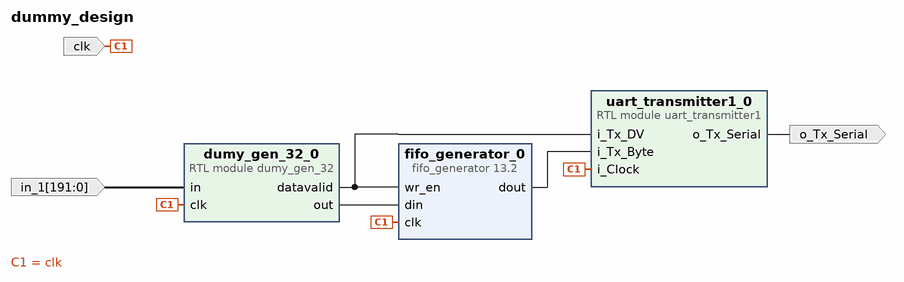
[diagram p0: block diagram of the top level]
# Vivado block design dummy_design, xcvu9p-flga2104-2L-e, Vivado 2019.1
create_bd_design dummy_design

create_bd_port -dir I -type clk clk
set_property -dict {CONFIG.FREQ_HZ 100000000} [get_bd_ports clk]
create_bd_port -dir I -from 191 -to 0 in_1
create_bd_port -dir O o_Tx_Serial

create_bd_cell -type module -reference uart_transmitter1 uart_transmitter1_0
create_bd_cell -type module -reference dumy_gen_32 dumy_gen_32_0
create_bd_cell -type ip -vlnv xilinx.com:ip:fifo_generator:13.2 fifo_generator_0
set_property -dict {CONFIG.Input_Data_Width 8 CONFIG.Input_Depth 512} [get_bd_cells fifo_generator_0]

# ---- connections ----

connect_bd_net [get_bd_pins dumy_gen_32_0/out] [get_bd_pins fifo_generator_0/din]
connect_bd_net [get_bd_pins dumy_gen_32_0/datavalid] [get_bd_pins fifo_generator_0/wr_en] [get_bd_pins uart_transmitter1_0/i_Tx_DV]
connect_bd_net [get_bd_pins fifo_generator_0/dout] [get_bd_pins uart_transmitter1_0/i_Tx_Byte]
connect_bd_net [get_bd_ports clk] [get_bd_pins dumy_gen_32_0/clk] [get_bd_pins fifo_generator_0/clk] [get_bd_pins uart_transmitter1_0/i_Clock]
connect_bd_net -net in_1_1 [get_bd_ports in_1] [get_bd_pins dumy_gen_32_0/in]
connect_bd_net [get_bd_pins uart_transmitter1_0/o_Tx_Serial] [get_bd_ports o_Tx_Serial]

validate_bd_design
save_bd_design
